# Altium schematic sheet (OLD) Motors.SchDoc
size A3; SheetNumber: 2; SheetTotal: 7
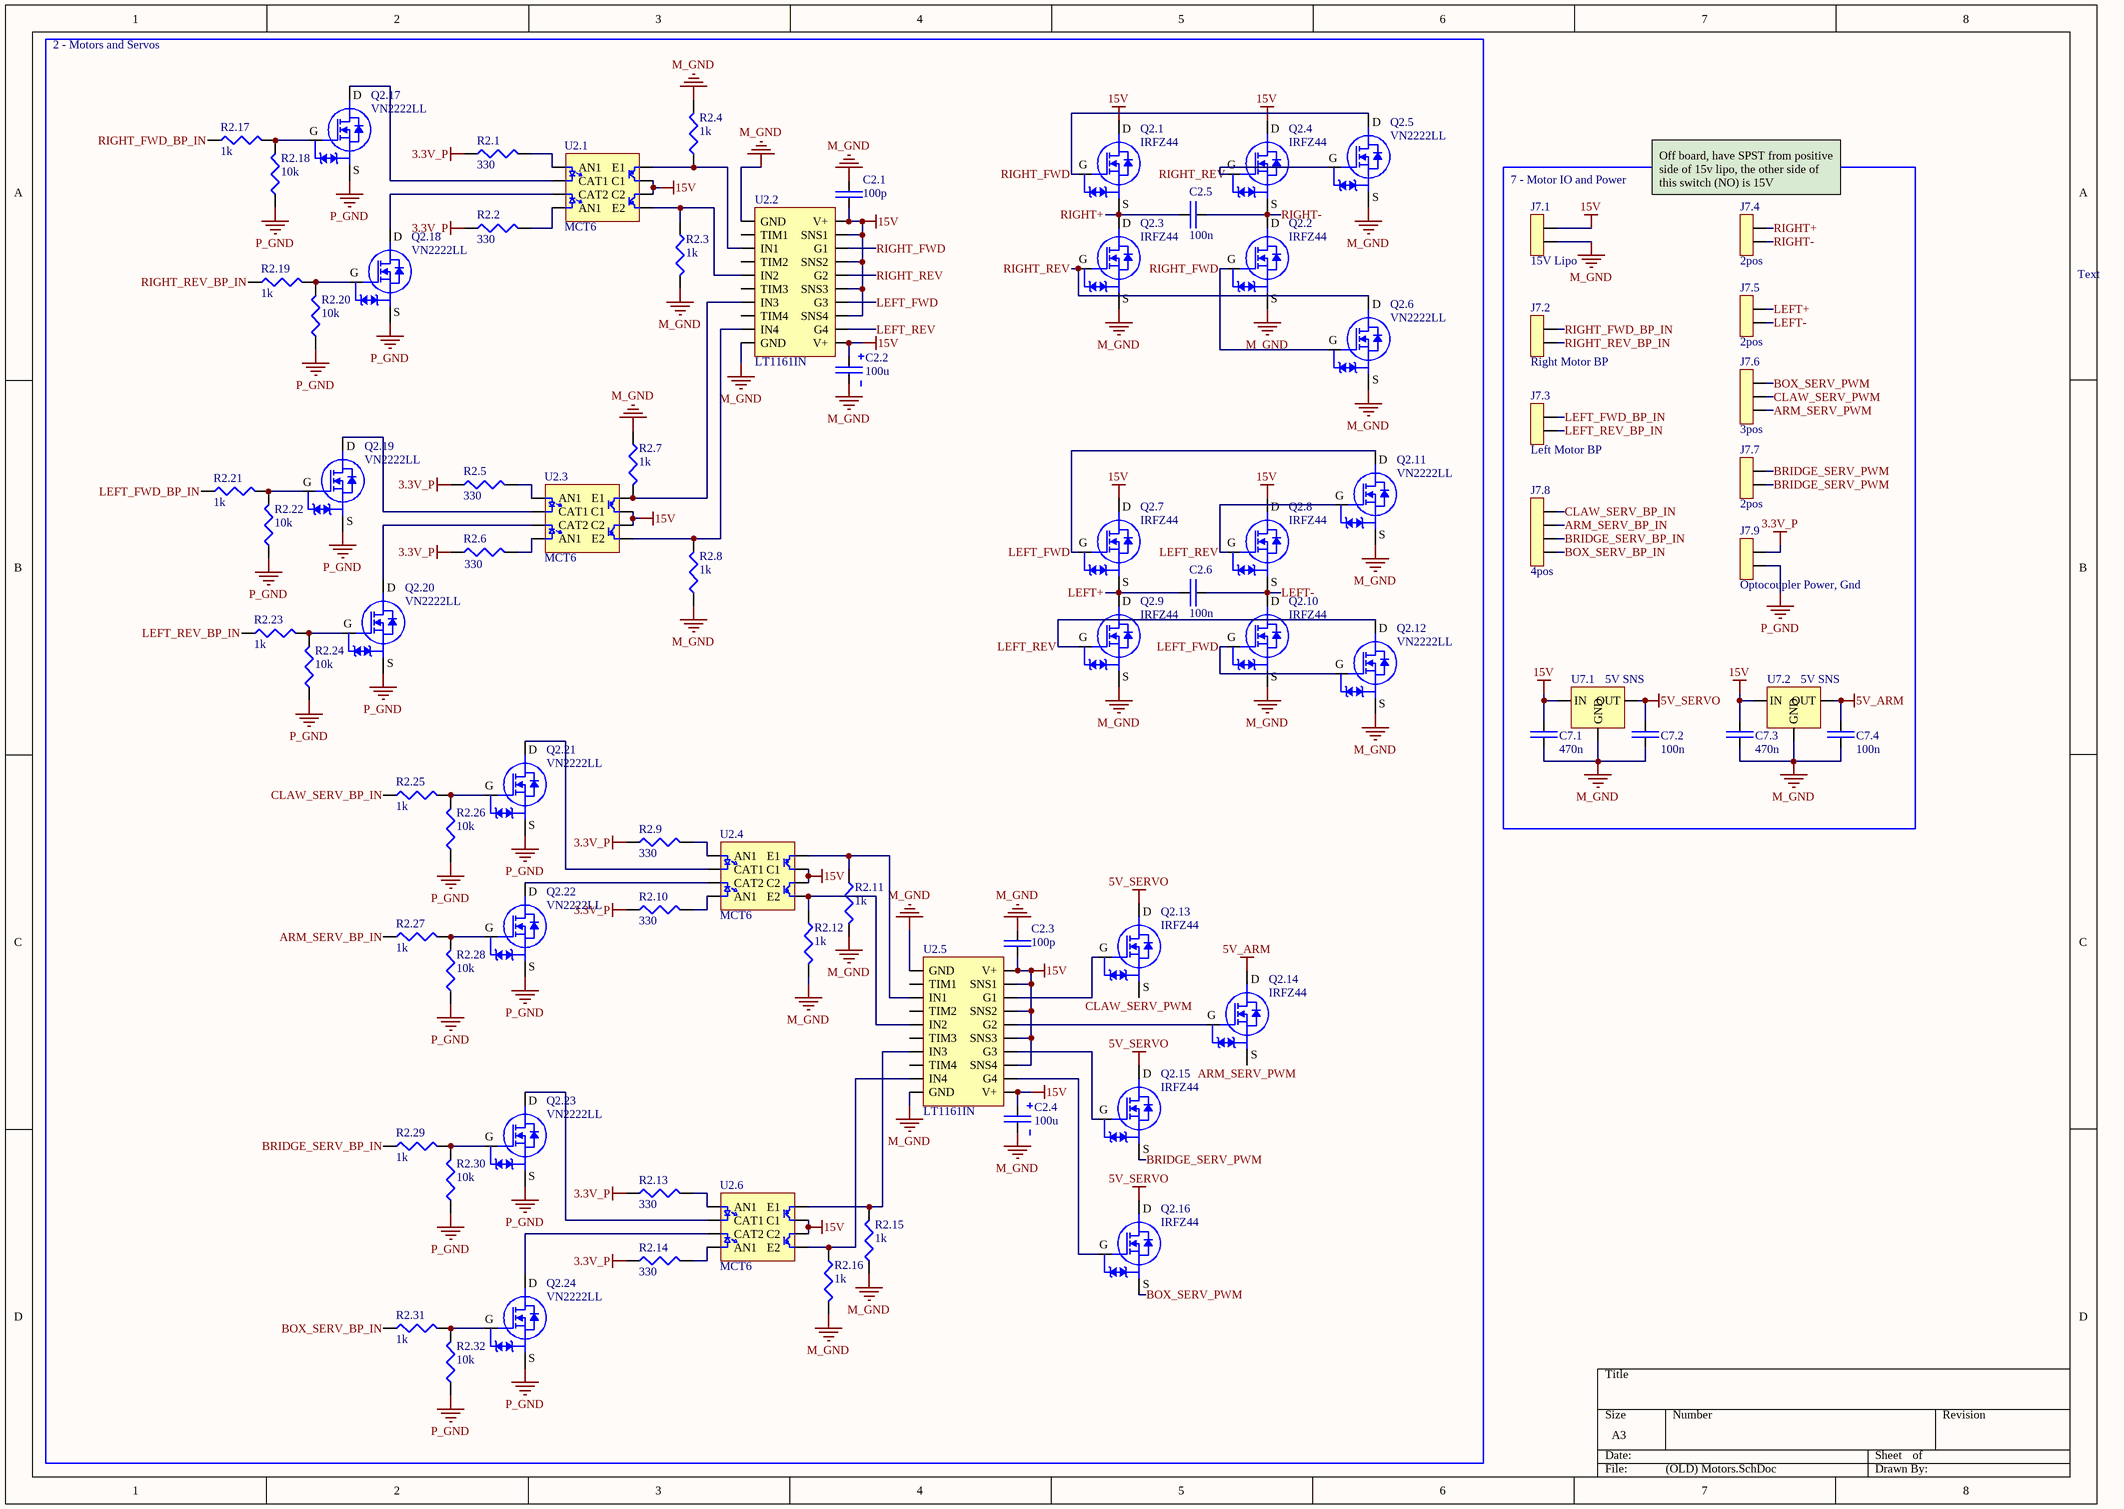
[diagram p0: (OLD) Motors.SchDoc]

## Parts
C2.1  100p  [Non Polarized Cap]
C2.2  100u  [Polarized Cap]
C2.3  100p  [Non Polarized Cap]
C2.4  100u  [Polarized Cap]
C2.5  100n  [Non Polarized Cap]
C2.6  100n  [Non Polarized Cap]
C7.1  470n  [Non Polarized Cap]
C7.2  100n  [Non Polarized Cap]
C7.3  470n  [Non Polarized Cap]
C7.4  100n  [Non Polarized Cap]
J7.1  15V Lipo  [2pos JST]
J7.2  Right Motor BP  [2pos JST]
J7.3  Left Motor BP  [2pos JST]
J7.4  2pos  [2pos JST]
J7.5  2pos  [2pos JST]
J7.6  3pos  [3pos JST]
J7.7  2pos  [2pos JST]
J7.8  4pos  [4Pos JST]
J7.9  Optocoupler Power, Gnd  [2pos JST]
Q2.1  IRFZ44  [TO220]
Q2.2  IRFZ44  [TO220]
Q2.3  IRFZ44  [TO220]
Q2.4  IRFZ44  [TO220]
Q2.5  VN2222LL  [VN2222LL]
Q2.6  VN2222LL  [VN2222LL]
Q2.7  IRFZ44  [TO220]
Q2.8  IRFZ44  [TO220]
Q2.9  IRFZ44  [TO220]
Q2.10  IRFZ44  [TO220]
Q2.11  VN2222LL  [VN2222LL]
Q2.12  VN2222LL  [VN2222LL]
Q2.13  IRFZ44  [TO220]
Q2.14  IRFZ44  [TO220]
Q2.15  IRFZ44  [TO220]
Q2.16  IRFZ44  [TO220]
Q2.17  VN2222LL  [VN2222LL]
Q2.18  VN2222LL  [VN2222LL]
Q2.19  VN2222LL  [VN2222LL]
Q2.20  VN2222LL  [VN2222LL]
Q2.21  VN2222LL  [VN2222LL]
Q2.22  VN2222LL  [VN2222LL]
Q2.23  VN2222LL  [VN2222LL]
Q2.24  VN2222LL  [VN2222LL]
R2.1  330  [Res_Generic]
R2.2  330  [Res_Generic]
R2.3  1k  [Res_Generic]
R2.4  1k  [Res_Generic]
R2.5  330  [Res_Generic]
R2.6  330  [Res_Generic]
R2.7  1k  [Res_Generic]
R2.8  1k  [Res_Generic]
R2.9  330  [Res_Generic]
R2.10  330  [Res_Generic]
R2.11  1k  [Res_Generic]
R2.12  1k  [Res_Generic]
R2.13  330  [Res_Generic]
R2.14  330  [Res_Generic]
R2.15  1k  [Res_Generic]
R2.16  1k  [Res_Generic]
R2.17  1k  [Res_Generic]
R2.18  10k  [Res_Generic]
R2.19  1k  [Res_Generic]
R2.20  10k  [Res_Generic]
R2.21  1k  [Res_Generic]
R2.22  10k  [Res_Generic]
R2.23  1k  [Res_Generic]
R2.24  10k  [Res_Generic]
R2.25  1k  [Res_Generic]
R2.26  10k  [Res_Generic]
R2.27  1k  [Res_Generic]
R2.28  10k  [Res_Generic]
R2.29  1k  [Res_Generic]
R2.30  10k  [Res_Generic]
R2.31  1k  [Res_Generic]
R2.32  10k  [Res_Generic]
U2.1  MCT6  [DIP8]
U2.2  LT1161IN  [DIP20]
U2.3  MCT6  [DIP8]
U2.4  MCT6  [DIP8]
U2.5  LT1161IN  [DIP20]
U2.6  MCT6  [DIP8]
U7.1  5V SNS  [TO220]
U7.2  5V SNS  [TO220]

## Blocks framed on the sheet
2 - Motors and Servos: C2.1-C2.6 Q2.1-Q2.24 R2.1-R2.32 U2.1-U2.6
7 - Motor IO and Power: C7.1-C7.4 J7.1-J7.9 U7.1 U7.2

## Nets
3.3V_P: J7.9.2 R2.1.1 R2.2.1 R2.5.1 R2.6.1 R2.9.1 R2.10.1 R2.13.1 R2.14.1
5V_ARM: C7.4.2 Q2.14.3(D) U7.2.3(OUT)
5V_SERVO: C7.2.2 Q2.13.3(D) Q2.15.3(D) Q2.16.3(D) U7.1.3(OUT)
15V: C2.1.1 C2.2.1 C2.3.1 C2.4.1 C7.1.2 C7.3.2 J7.1.2 Q2.1.3(D) Q2.4.3(D) Q2.7.3(D) Q2.8.3(D) U2.1.6(C2) U2.1.7(C1) U2.2.11(V+) U2.2.13(SNS4) U2.2.15(SNS3) U2.2.17(SNS2) U2.2.19(SNS1) U2.2.20(V+) U2.3.6(C2) U2.3.7(C1) U2.4.6(C2) U2.4.7(C1) U2.5.11(V+) U2.5.13(SNS4) U2.5.15(SNS3) U2.5.17(SNS2) U2.5.19(SNS1) U2.5.20(V+) U2.6.6(C2) U2.6.7(C1) U7.1.1(IN) U7.2.1(IN)
M_GND: C2.1.2 C2.2.2 C2.3.2 C2.4.2 C7.1.1 C7.2.1 C7.3.1 C7.4.1 J7.1.1 Q2.2.2(S) Q2.3.2(S) Q2.5.2(S) Q2.6.2(S) Q2.9.2(S) Q2.10.2(S) Q2.11.2(S) Q2.12.2(S) R2.3.2 R2.4.2 R2.7.1 R2.8.1 R2.11.2 R2.12.2 R2.15.1 R2.16.2 U2.2.1(GND) U2.2.10(GND) U2.5.1(GND) U2.5.10(GND) U7.1.2(GND) U7.2.2(GND)
P_GND: J7.9.1 Q2.17.2(S) Q2.18.2(S) Q2.19.2(S) Q2.20.2(S) Q2.21.2(S) Q2.22.2(S) Q2.23.2(S) Q2.24.2(S) R2.18.1 R2.20.1 R2.22.1 R2.24.1 R2.26.1 R2.28.1 R2.30.1 R2.32.1
ARM_SERV_BP_IN: J7.8.3 R2.27.1
ARM_SERV_PWM: J7.6.1 Q2.14.2(S)
BOX_SERV_BP_IN: J7.8.1 R2.31.1
BOX_SERV_PWM: J7.6.3 Q2.16.2(S)
BRIDGE_SERV_BP_IN: J7.8.2 R2.29.1
BRIDGE_SERV_PWM: J7.7.1 J7.7.2 Q2.15.2(S)
CLAW_SERV_BP_IN: J7.8.4 R2.25.1
CLAW_SERV_PWM: J7.6.2 Q2.13.2(S)
LEFT+: C2.6.1 J7.5.2 Q2.7.2(S) Q2.9.3(D)
LEFT-: C2.6.2 J7.5.1 Q2.8.2(S) Q2.10.3(D)
LEFT_FWD: Q2.7.1(G) Q2.10.1(G) Q2.11.3(D) Q2.12.1(G) U2.2.14(G3)
LEFT_FWD_BP_IN: J7.3.2 R2.21.1
LEFT_REV: Q2.8.1(G) Q2.9.1(G) Q2.11.1(G) Q2.12.3(D) U2.2.12(G4)
LEFT_REV_BP_IN: J7.3.1 R2.23.1
RIGHT+: C2.5.1 J7.4.2 Q2.1.2(S) Q2.3.3(D)
RIGHT-: C2.5.2 J7.4.1 Q2.2.3(D) Q2.4.2(S)
RIGHT_FWD: Q2.1.1(G) Q2.2.1(G) Q2.5.3(D) Q2.6.1(G) U2.2.18(G1)
RIGHT_FWD_BP_IN: J7.2.2 R2.17.1
RIGHT_REV: Q2.3.1(G) Q2.4.1(G) Q2.5.1(G) Q2.6.3(D) U2.2.16(G2)
RIGHT_REV_BP_IN: J7.2.1 R2.19.1
NetQ2.13_1: Q2.13.1(G) U2.5.18(G1)
NetQ2.14_1: Q2.14.1(G) U2.5.16(G2)
NetQ2.15_1: Q2.15.1(G) U2.5.14(G3)
NetQ2.16_1: Q2.16.1(G) U2.5.12(G4)
NetQ2.17_1: Q2.17.1(G) R2.17.2 R2.18.2
NetQ2.17_3: Q2.17.3(D) U2.1.2(CAT1)
NetQ2.18_1: Q2.18.1(G) R2.19.2 R2.20.2
NetQ2.18_3: Q2.18.3(D) U2.1.3(CAT2)
NetQ2.19_1: Q2.19.1(G) R2.21.2 R2.22.2
NetQ2.19_3: Q2.19.3(D) U2.3.2(CAT1)
NetQ2.20_1: Q2.20.1(G) R2.23.2 R2.24.2
NetQ2.20_3: Q2.20.3(D) U2.3.3(CAT2)
NetQ2.21_1: Q2.21.1(G) R2.25.2 R2.26.2
NetQ2.21_3: Q2.21.3(D) U2.4.2(CAT1)
NetQ2.22_1: Q2.22.1(G) R2.27.2 R2.28.2
NetQ2.22_3: Q2.22.3(D) U2.4.3(CAT2)
NetQ2.23_1: Q2.23.1(G) R2.29.2 R2.30.2
NetQ2.23_3: Q2.23.3(D) U2.6.2(CAT1)
NetQ2.24_1: Q2.24.1(G) R2.31.2 R2.32.2
NetQ2.24_3: Q2.24.3(D) U2.6.3(CAT2)
NetR2.1_2: R2.1.2 U2.1.1(AN1)
NetR2.2_2: R2.2.2 U2.1.4(AN1)
NetR2.3_1: R2.3.1 U2.1.5(E2) U2.2.5(IN2)
NetR2.4_1: R2.4.1 U2.1.8(E1) U2.2.3(IN1)
NetR2.5_2: R2.5.2 U2.3.1(AN1)
NetR2.6_2: R2.6.2 U2.3.4(AN1)
NetR2.7_2: R2.7.2 U2.2.7(IN3) U2.3.8(E1)
NetR2.8_2: R2.8.2 U2.2.9(IN4) U2.3.5(E2)
NetR2.9_2: R2.9.2 U2.4.1(AN1)
NetR2.10_2: R2.10.2 U2.4.4(AN1)
NetR2.11_1: R2.11.1 U2.4.8(E1) U2.5.3(IN1)
NetR2.12_1: R2.12.1 U2.4.5(E2) U2.5.5(IN2)
NetR2.13_2: R2.13.2 U2.6.1(AN1)
NetR2.14_2: R2.14.2 U2.6.4(AN1)
NetR2.15_2: R2.15.2 U2.5.7(IN3) U2.6.8(E1)
NetR2.16_1: R2.16.1 U2.5.9(IN4) U2.6.5(E2)

Not connected (* = marked no-connect by the designer): U2.2 2(TIM1) 4(TIM2) 6(TIM3) 8(TIM4); U2.5 2(TIM1) 4(TIM2) 6(TIM3) 8(TIM4)

## Notes on the sheet
- (near J7.4) Off board, have SPST from positive side of 15v lipo, the other side of this switch (NO) is 15V
- Text

## Library data of the parts
C2.1 C2.3 C2.5 C2.6 C7.1-C7.4 = Cap_Generic
C2.2 C2.4 = Polarized Cap
J7.1-J7.5 J7.7 J7.9 = 2pos Conn: 2pos Conn JST
J7.6 = 3pos Conn
J7.8 = 4pos Conn
Q2.1-Q2.4 Q2.7-Q2.10 Q2.13-Q2.16 = IRFZ44 NMOS: IRFZ44EPBF N-Channel 60 V 48A 110W Through Hole TO-220AB; Supplier 1: Digi-Key; Supplier Part Number 1: IRFZ44ZLPBF-ND
Q2.5 Q2.6 Q2.11 Q2.12 Q2.17-Q2.24 = VN2222LL NMOS: VN2222LL N-Channel 60 V 150mA 400mW Through Hole TO-92 (TO-226); Supplier 1: Mouser; Supplier Part Number 1: 689-VN2222LL-G
R2.1-R2.32 = Res_Generic
U2.1 U2.3 U2.4 U2.6 = MCT6 Optocoupler: Optoisolator 5.3KV 2CH TRANS 8-DIP; Supplier 1: Mouser; Supplier Part Number 1: 512-MCT6
U2.2 U2.5 = LT1161IN Gate Driver: LT1161IN High-Side Gate Driver IC Non-Inverting 20-PDIP; Supplier 1: Digi-Key; Supplier Part Number 1: LT1161IN#PBF-ND
U7.1 U7.2 = UA7805 5V Reg: UA7805 IC REG LINEAR 5V 1.5A TO220-3; Supplier 1: Digi-Key; Supplier Part Number 1: 296-39515-5-ND